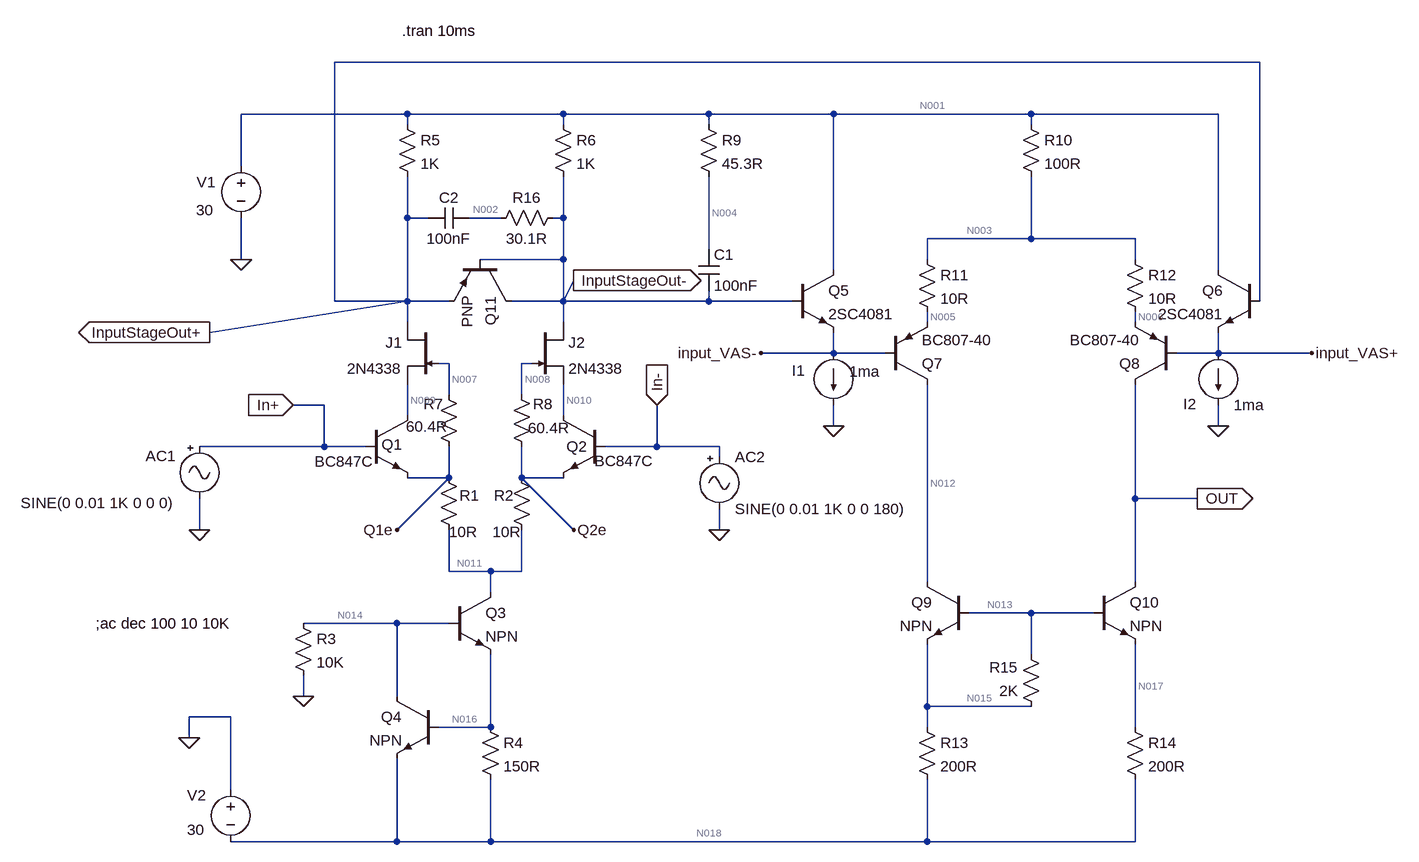
[diagram p0: schematic Draft1.asc]
Draft1.asc, the LTspice schematic file:
Version 4
SHEET 1 1688 752
WIRE 1456 -464 32 -464
WIRE 144 -384 -112 -384
WIRE 384 -384 144 -384
WIRE 608 -384 384 -384
WIRE 800 -384 608 -384
WIRE 1104 -384 800 -384
WIRE 1392 -384 1104 -384
WIRE 144 -368 144 -384
WIRE 384 -368 384 -384
WIRE 608 -368 608 -384
WIRE 1104 -368 1104 -384
WIRE -112 -304 -112 -384
WIRE 144 -224 144 -288
WIRE 176 -224 144 -224
WIRE 288 -224 240 -224
WIRE 384 -224 384 -288
WIRE 384 -224 368 -224
WIRE 1104 -192 1104 -288
WIRE 1104 -192 944 -192
WIRE 1264 -192 1104 -192
WIRE 608 -176 608 -288
WIRE -112 -160 -112 -224
WIRE 384 -160 384 -224
WIRE 384 -160 256 -160
WIRE 944 -160 944 -192
WIRE 1264 -160 1264 -192
WIRE 800 -144 800 -384
WIRE 1392 -144 1392 -384
WIRE 32 -96 32 -464
WIRE 144 -96 144 -224
WIRE 144 -96 32 -96
WIRE 208 -96 144 -96
WIRE 384 -96 384 -160
WIRE 384 -96 400 -128
WIRE 384 -96 304 -96
WIRE 608 -96 608 -112
WIRE 608 -96 384 -96
WIRE 736 -96 608 -96
WIRE 1456 -96 1456 -464
WIRE 144 -64 144 -96
WIRE 384 -64 384 -96
WIRE 944 -64 944 -80
WIRE 1264 -64 1264 -80
WIRE -160 -48 144 -96
WIRE 800 -16 800 -48
WIRE 800 -16 688 -16
WIRE 880 -16 800 -16
WIRE 1392 -16 1392 -48
WIRE 1392 -16 1328 -16
WIRE 1536 -16 1392 -16
WIRE 208 0 192 0
WIRE 336 0 320 0
WIRE 208 48 208 0
WIRE 320 48 320 0
WIRE 16 64 -32 64
WIRE 144 80 144 32
WIRE 384 80 384 32
WIRE 800 96 800 64
WIRE 1392 96 1392 64
WIRE 16 128 16 64
WIRE 16 128 -176 128
WIRE 80 128 16 128
WIRE 528 128 528 64
WIRE 528 128 448 128
WIRE 624 128 528 128
WIRE 624 144 624 128
WIRE 208 176 208 128
WIRE 208 176 144 176
WIRE 320 176 320 128
WIRE 384 176 320 176
WIRE 1264 208 1264 32
WIRE 1360 208 1264 208
WIRE -176 256 -176 208
WIRE 128 256 208 176
WIRE 400 256 320 176
WIRE 624 256 624 224
WIRE 208 320 208 256
WIRE 272 320 208 320
WIRE 320 320 320 256
WIRE 320 320 272 320
WIRE 944 336 944 32
WIRE 1264 336 1264 208
WIRE 272 352 272 320
WIRE 1104 384 1008 384
WIRE 1200 384 1104 384
WIRE 128 400 -16 400
WIRE 208 400 128 400
WIRE 1104 448 1104 384
WIRE -16 512 -16 480
WIRE 128 512 128 400
WIRE 944 528 944 432
WIRE 1104 528 944 528
WIRE -128 544 -192 544
WIRE 272 560 272 448
WIRE 272 560 192 560
WIRE 944 560 944 528
WIRE 1264 560 1264 432
WIRE -192 576 -192 544
WIRE -128 656 -128 544
WIRE 128 736 128 608
WIRE 128 736 -128 736
WIRE 272 736 272 640
WIRE 272 736 128 736
WIRE 944 736 944 640
WIRE 944 736 272 736
WIRE 1264 736 1264 640
WIRE 1264 736 944 736
FLAG -16 512 0
FLAG -112 -160 0
FLAG -192 576 0
FLAG 800 96 0
FLAG -176 256 0
FLAG -32 64 In+
IOPIN -32 64 In
FLAG 528 64 In-
IOPIN 528 64 In
FLAG -160 -48 InputStageOut+
IOPIN -160 -48 Out
FLAG 400 -128 InputStageOut-
IOPIN 400 -128 Out
FLAG 128 256 Q1e
FLAG 400 256 Q2e
FLAG 1392 96 0
FLAG 688 -16 input_VAS-
FLAG 1536 -16 input_VAS+
FLAG 624 256 0
FLAG 1360 208 OUT
IOPIN 1360 208 Out
SYMBOL npn 80 80 R0
WINDOW 0 24 45 Left 2
WINDOW 3 -79 71 Left 2
SYMATTR InstName Q1
SYMATTR Value BC847C
SYMBOL npn 448 80 M0
WINDOW 0 27 48 Left 2
WINDOW 3 -75 70 Left 2
SYMATTR InstName Q2
SYMATTR Value BC847C
SYMBOL npn 208 352 R0
SYMATTR InstName Q3
SYMBOL npn 192 512 M0
SYMATTR InstName Q4
SYMBOL res 192 160 R0
WINDOW 0 32 43 Left 2
WINDOW 3 16 99 Left 2
SYMATTR InstName R1
SYMATTR Value 10R
SYMBOL res 304 160 R0
WINDOW 0 -27 43 Left 2
WINDOW 3 -29 99 Left 2
SYMATTR InstName R2
SYMATTR Value 10R
SYMBOL res -32 384 R0
SYMATTR InstName R3
SYMATTR Value 10K
SYMBOL res 256 544 R0
SYMATTR InstName R4
SYMATTR Value 150R
SYMBOL res 128 -384 R0
SYMATTR InstName R5
SYMATTR Value 1K
SYMBOL res 368 -384 R0
SYMATTR InstName R6
SYMATTR Value 1K
SYMBOL voltage -112 -320 R0
WINDOW 0 -68 41 Left 2
WINDOW 3 -69 84 Left 2
WINDOW 123 0 0 Left 0
WINDOW 39 0 0 Left 0
SYMATTR InstName V1
SYMATTR Value 30
SYMBOL voltage -128 640 R0
WINDOW 0 -67 25 Left 2
WINDOW 3 -67 78 Left 2
WINDOW 123 0 0 Left 0
WINDOW 39 0 0 Left 0
SYMATTR InstName V2
SYMATTR Value 30
SYMBOL Misc\\signal -176 112 R0
WINDOW 123 24 44 Left 2
WINDOW 39 0 0 Left 0
WINDOW 0 -83 30 Left 2
WINDOW 3 -275 103 Left 2
SYMATTR InstName AC1
SYMATTR Value SINE(0 0.01 1K 0 0 0)
SYMBOL njf 192 -64 M0
SYMATTR InstName J1
SYMATTR Value 2N4338
SYMBOL njf 336 -64 R0
SYMATTR InstName J2
SYMATTR Value 2N4338
SYMBOL res 192 32 R0
WINDOW 0 -23 30 Left 2
WINDOW 3 -50 65 Left 2
SYMATTR InstName R7
SYMATTR Value 60.4R
SYMBOL res 304 32 R0
WINDOW 0 33 30 Left 2
WINDOW 3 26 67 Left 2
SYMATTR InstName R8
SYMATTR Value 60.4R
SYMBOL npn 736 -144 R0
SYMATTR InstName Q5
SYMATTR Value 2SC4081
SYMBOL npn 1456 -144 M0
SYMATTR InstName Q6
SYMATTR Value 2SC4081
SYMBOL current 800 -16 R0
WINDOW 0 -64 27 Left 2
WINDOW 3 24 28 Left 2
WINDOW 123 0 0 Left 0
WINDOW 39 0 0 Left 0
SYMATTR InstName I1
SYMATTR Value 1ma
SYMBOL current 1392 -16 R0
WINDOW 0 -54 78 Left 2
WINDOW 123 0 0 Left 0
WINDOW 39 0 0 Left 0
SYMATTR InstName I2
SYMATTR Value 1ma
SYMBOL res 592 -384 R0
SYMATTR InstName R9
SYMATTR Value 45.3R
SYMBOL cap 592 -176 R0
SYMATTR InstName C1
SYMATTR Value 100nF
SYMBOL Misc\\signal 624 128 R0
WINDOW 123 0 0 Left 0
WINDOW 39 0 0 Left 0
SYMATTR InstName AC2
SYMATTR Value SINE(0 0.01 1K 0 0 180)
SYMBOL pnp 880 32 M180
SYMATTR InstName Q7
SYMATTR Value BC807-40
SYMBOL pnp 1328 32 R180
SYMATTR InstName Q8
SYMATTR Value BC807-40
SYMBOL res 1088 -384 R0
SYMATTR InstName R10
SYMATTR Value 100R
SYMBOL res 928 -176 R0
SYMATTR InstName R11
SYMATTR Value 10R
SYMBOL res 1248 -176 R0
SYMATTR InstName R12
SYMATTR Value 10R
SYMBOL npn 1008 336 M0
SYMATTR InstName Q9
SYMBOL npn 1200 336 R0
SYMATTR InstName Q10
SYMBOL res 928 544 R0
SYMATTR InstName R13
SYMATTR Value 200R
SYMBOL res 1248 544 R0
SYMATTR InstName R14
SYMATTR Value 200R
SYMBOL res 1120 544 R180
WINDOW 0 36 76 Left 2
WINDOW 3 36 40 Left 2
SYMATTR InstName R15
SYMATTR Value 2K
SYMBOL pnp 304 -160 R90
SYMATTR InstName Q11
SYMBOL res 384 -240 R90
WINDOW 0 0 56 VBottom 2
WINDOW 3 32 56 VTop 2
SYMATTR InstName R16
SYMATTR Value 30.1R
SYMBOL cap 240 -240 R90
WINDOW 0 0 32 VBottom 2
WINDOW 3 32 32 VTop 2
SYMATTR InstName C2
SYMATTR Value 100nF
TEXT -336 400 Left 2 !;ac dec 100 10 10K
TEXT 136 -512 Left 2 !.tran 10ms

The netlist it stands for:
* Draft1.asc
Q1 N009 In+ Q1e 0 BC847C
Q2 N010 In- Q2e 0 BC847C
Q3 N011 N014 N016 0 NPN
Q4 N014 N016 N018 0 NPN
R1 Q1e N011 10R
R2 Q2e N011 10R
R3 N014 0 10K
R4 N016 N018 150R
R5 N001 InputStageOut+ 1K
R6 N001 InputStageOut- 1K
V1 N001 0 30
V2 0 N018 30
V§AC1 In+ 0 SINE(0 0.01 1K 0 0 0)
J1 InputStageOut+ N007 N009 2N4338
J2 InputStageOut- N008 N010 2N4338
R7 N007 Q1e 60.4R
R8 N008 Q2e 60.4R
Q5 N001 InputStageOut- input_VAS- 0 2SC4081
Q6 N001 InputStageOut+ input_VAS+ 0 2SC4081
I1 input_VAS- 0 1ma
I2 input_VAS+ 0 1ma
R9 N001 N004 45.3R
C1 N004 InputStageOut- 100nF
V§AC2 In- 0 SINE(0 0.01 1K 0 0 180)
Q7 N012 input_VAS- N005 0 BC807-40
Q8 OUT input_VAS+ N006 0 BC807-40
R10 N001 N003 100R
R11 N003 N005 10R
R12 N003 N006 10R
Q9 N012 N013 N015 0 NPN
Q10 OUT N013 N017 0 NPN
R13 N015 N018 200R
R14 N017 N018 200R
R15 N015 N013 2K
Q11 InputStageOut- InputStageOut- InputStageOut+ 0 PNP
R16 InputStageOut- N002 30.1R
C2 N002 InputStageOut+ 100nF
.model NPN NPN
.model PNP PNP
.lib standard.bjt
.model NJF NJF
.model PJF PJF
.lib standard.jft
;ac dec 100 10 10K
.tran 10ms
.backanno
.end

* Results of the author's LTspice run, read from the files saved beside the schematic
* Operating Point, zero values left out:
*   V(n009) = -719.9 mV
*   V(q1e) = -725.4 mV
*   V(n010) = -719.9 mV
*   V(q2e) = -725.4 mV
*   V(n011) = -752 mV
*   V(n014) = -28.38 V
*   V(n016) = -29.2 V
*   V(n018) = -30 V
*   V(n001) = 30 V
*   V(inputstageout+) = 29.65 V
*   V(inputstageout-) = 29.65 V
*   V(n007) = -725.4 mV
*   V(n008) = -725.4 mV
*   V(input_vas-) = 29.14 V
*   V(input_vas+) = 29.14 V
*   V(n004) = 30 V
*   V(n012) = 29.79 V
*   V(n005) = 29.8 V
*   V(out) = 29.79 V
*   V(n006) = 29.8 V
*   V(n003) = 29.81 V
*   V(n013) = -30 V
*   V(n015) = -30 V
*   V(n017) = -30 V
*   V(n002) = 29.65 V
*   Ic(Q8) = -59.8 pA
*   Ib(Q8) = -965.9 µA
*   Ie(Q8) = 965.9 µA
*   Ic(Q7) = -59.8 pA
*   Ib(Q7) = -965.8 µA
*   Ie(Q7) = 965.9 µA
*   Ic(Q6) = 33.95 µA
*   Ib(Q6) = 125.5 nA
*   Ie(Q6) = -34.08 µA
*   Ic(Q5) = 33.95 µA
*   Ib(Q5) = 125.5 nA
*   Ie(Q5) = -34.08 µA
*   Ic(Q10) = 59.79 pA
*   Ib(Q10) = -59.79 pA
*   Ic(Q9) = 59.79 pA
*   Ib(Q9) = -59.79 pA
*   Ic(Q4) = 2.785 mA
*   Ib(Q4) = 27.85 µA
*   Ie(Q4) = -2.813 mA
*   Ic(Q3) = 5.313 mA
*   Ib(Q3) = 53.13 µA
*   Ie(Q3) = -5.366 mA
*   Ic(Q2) = 346.7 µA
*   Ib(Q2) = 2.31 mA
*   Ie(Q2) = -2.656 mA
*   Ic(Q1) = 346.7 µA
*   Ib(Q1) = 2.31 mA
*   Ie(Q1) = -2.656 mA
*   I(I2) = 1 mA
*   I(I1) = 1 mA
*   Id(J2) = 346.7 µA
*   Ig(J2) = -1.128 nA
*   Is(J2) = -346.7 µA
*   Id(J1) = 346.7 µA
*   Ig(J1) = -1.128 nA
*   Is(J1) = -346.7 µA
*   I(R15) = -119.6 pA
*   I(R13) = 119.6 pA
*   I(R12) = 965.9 µA
*   I(R11) = 965.9 µA
*   I(R10) = 1.932 mA
*   I(R8) = 1.128 nA
*   I(R7) = 1.128 nA
*   I(R6) = 346.8 µA
*   I(R5) = 346.8 µA
*   I(R4) = 5.338 mA
*   I(R3) = -2.838 mA
*   I(R2) = 2.656 mA
*   I(R1) = 2.656 mA
*   I(Ac2) = -2.31 mA
*   I(Ac1) = -2.31 mA
*   I(V2) = -8.151 mA
*   I(V1) = -2.693 mA
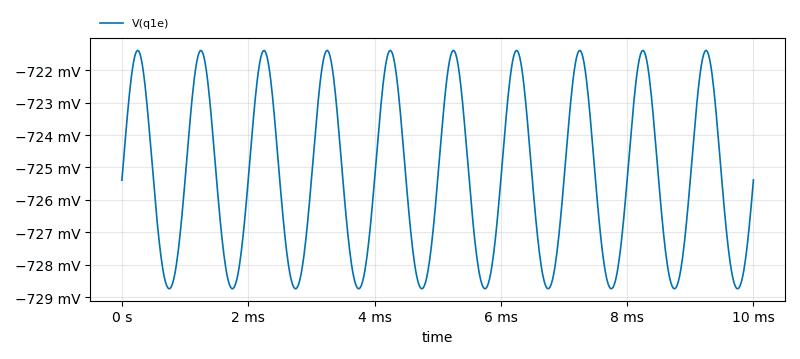
[diagram p1: Transient Analysis of Draft1.asc, plotted from the saved traces]
* Transient Analysis, 1 run:
*   V(q1e): min -728.7 mV, max -721.4 mV, average -725.2 mV, rms 725.2 mV, last -725.4 mV